# EasyEDA Pro project Project002.eprj

# Schematic 小车电路原理图
Board Name: Board1; Create Date: 2025-11-09; Page Name: P1; Project Name: Project002; Schematic Name: 小车电路原理图; Update Date: 2025-11-13; Company: 嘉立创EDA; Page Size: A4; Version: V1.0
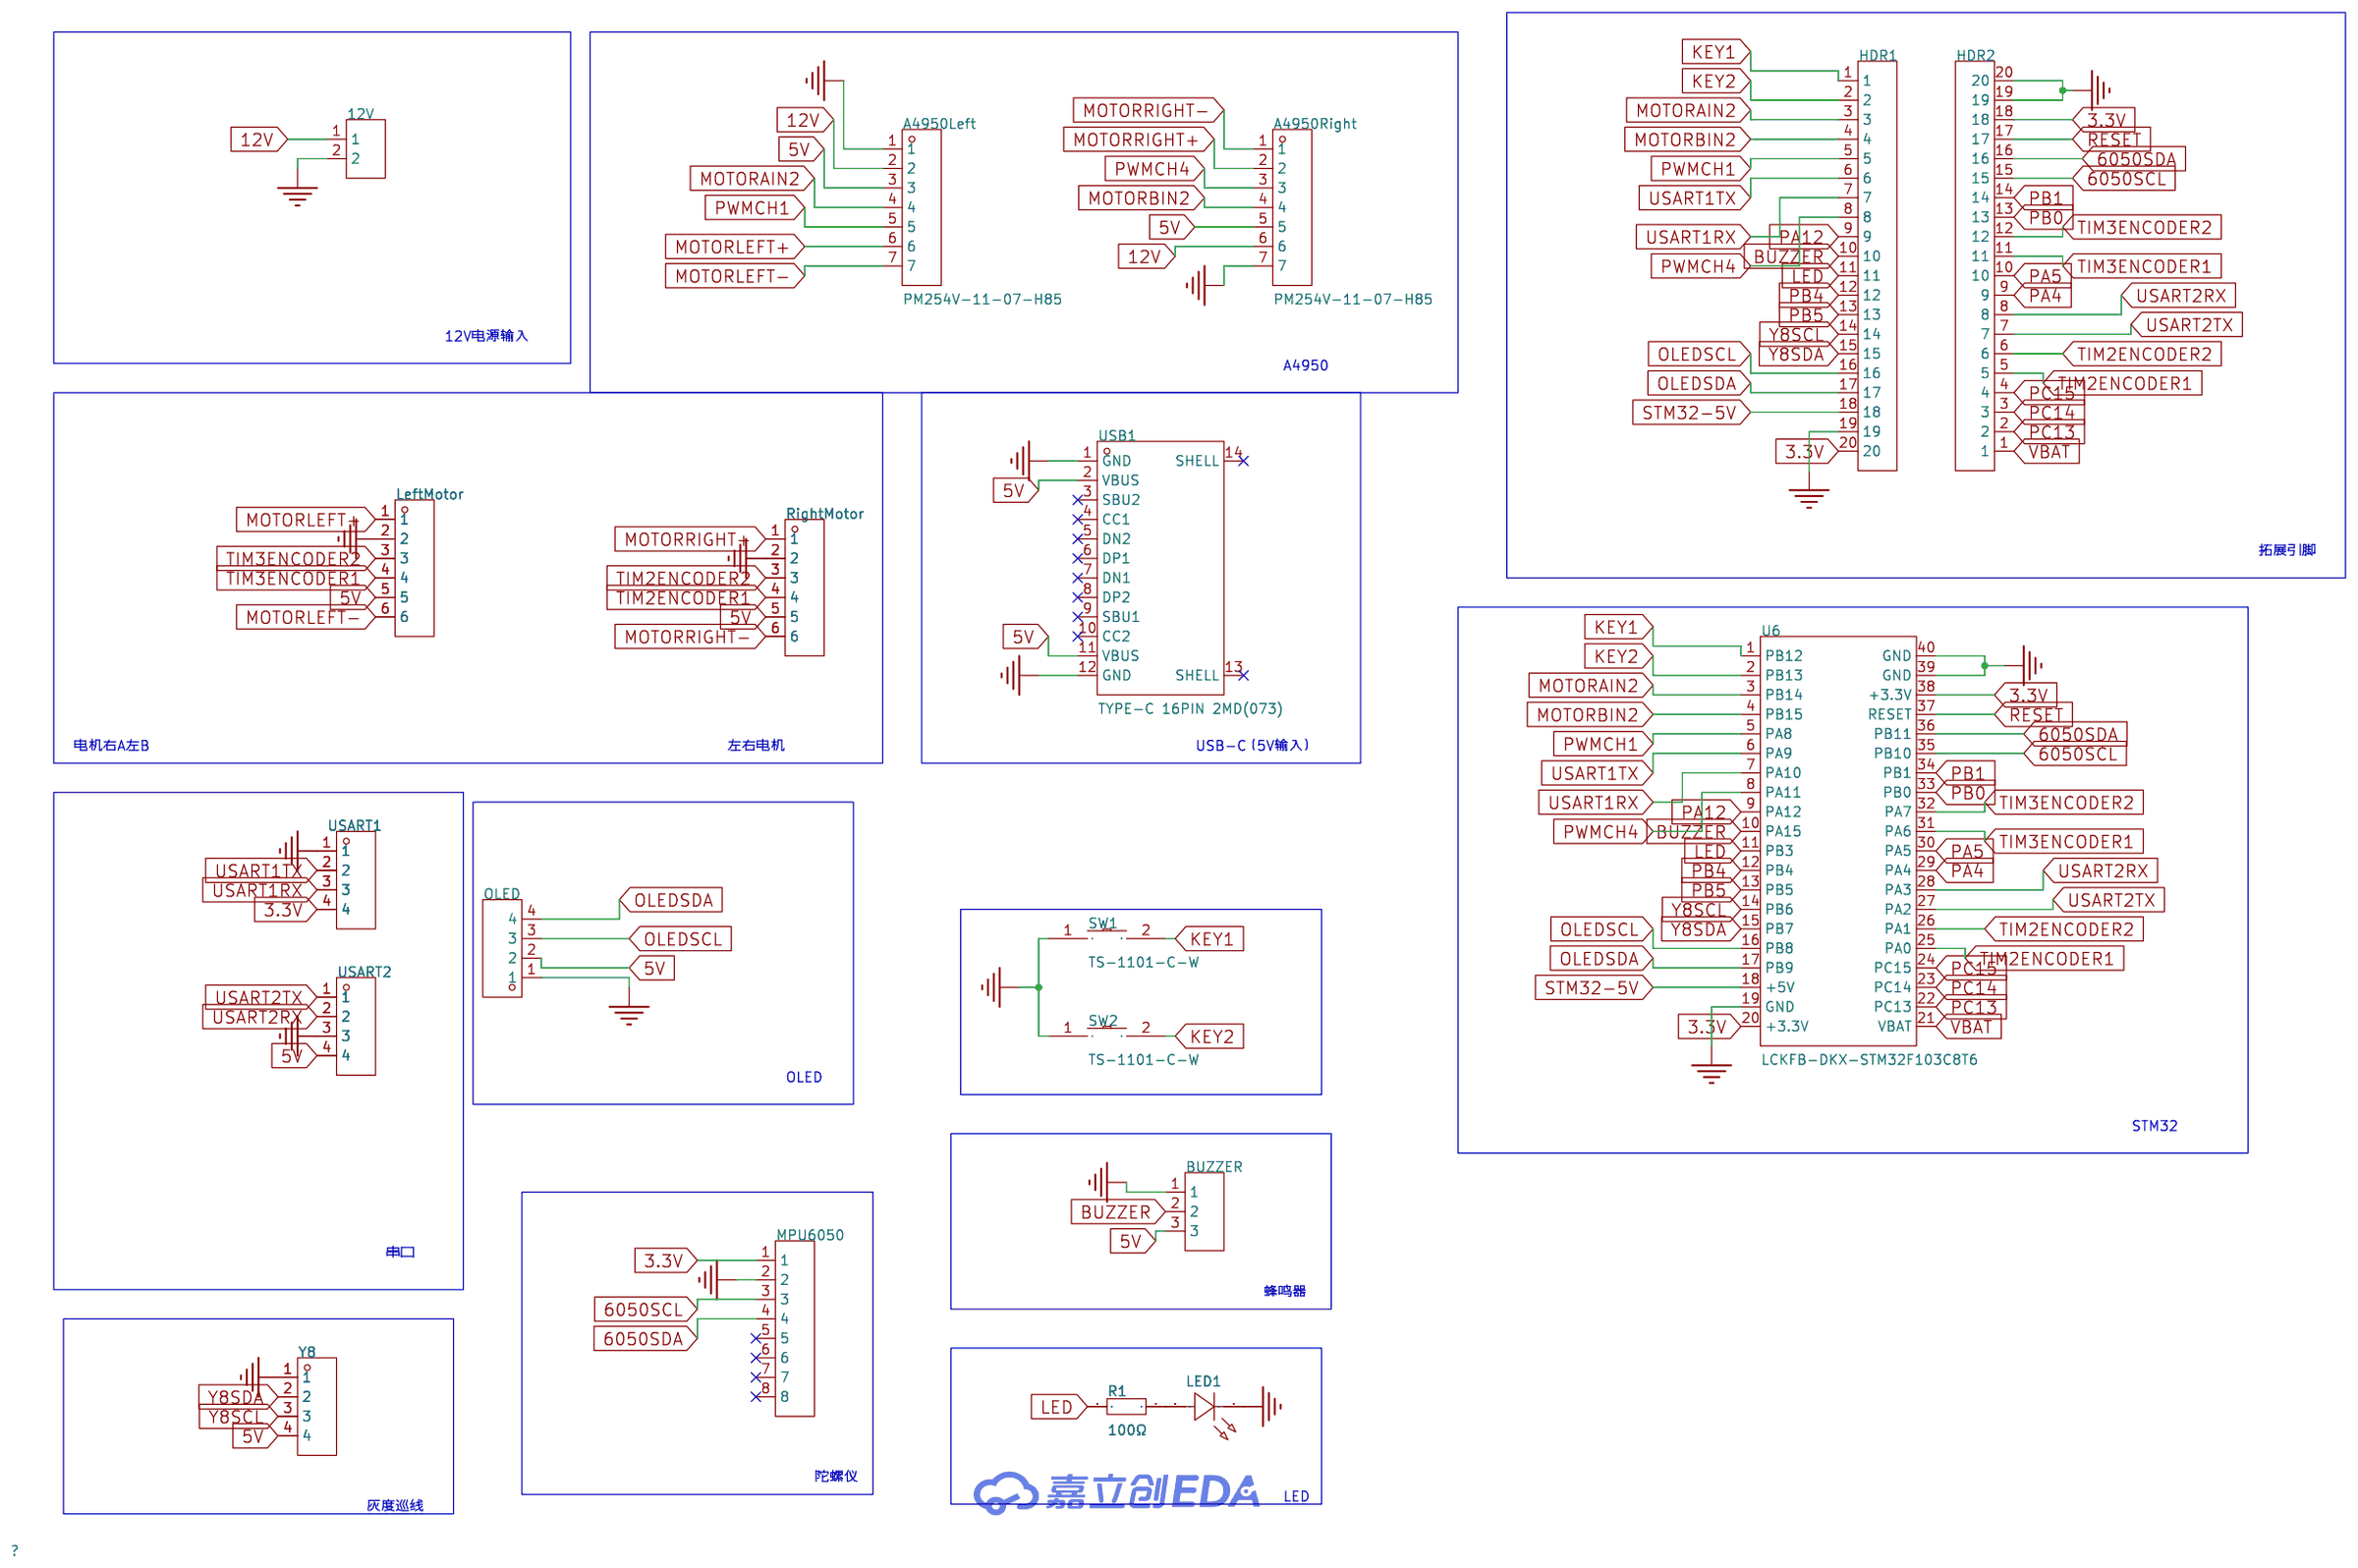
[diagram p0: schematic sheet]

## Parts
12V  12V  [CONN-TH_2P-P2.50_HX25003-2A]
A4950Left  PM254V-11-07-H85  [HDR-TH_7P-P2.54-V-F]
A4950Right  PM254V-11-07-H85  [HDR-TH_7P-P2.54-V-F]
BUZZER  PM254V-11-03-H85  [HDR-TH_3P-P2.54-V-F]
HDR1  PH2.54-01-20PZD  [HDR-TH_20P-P2.54-V-M-4]
HDR2  PH2.54-01-20PZD  [HDR-TH_20P-P2.54-V-M-4]
LED1  3A2RUD  [LED-TH_BD3.5-P2.28_3A2RUC]
LeftMotor  LeftMotor  [CONN-TH_6P-P2.50_ZX-XH2.54-6PZZ]
MPU6050  2.54-1*8P母环保  [HDR-TH_8P-P2.54-V-F_2]
OLED  USART1  [HDR-TH_4P-P2.54-V-F]
R1  100Ω  [R0603]
RightMotor  RightMotor  [CONN-TH_6P-P2.50_ZX-XH2.54-6PZZ]
SW1  TS-1101-C-W  [SW-SMD_L6.0-W3.3-LS8.0]
SW2  TS-1101-C-W  [SW-SMD_L6.0-W3.3-LS8.0]
U6  LCKFB-DKX-STM32F103C8T6  [CONN-TH_L53.3-W22.9_STM32F103C8T6-CARD]
USART1  USART1  [HDR-TH_4P-P2.54-V-F]
USART2  USART2  [HDR-TH_4P-P2.54-V-F]
USB1  TYPE-C 16PIN 2MD(073)  [USB-C-SMD_TYPE-C-6PIN-2MD-073]
Y8  PH2.0-4P  [CONN-TH_PH2.0-4P]

## Library data of the parts
12V = ZX-XH2.54-2PZZ: 插针结构:1x2P;间距:2.5mm;安装方式:直插;参考系列:XH;总PIN数:2P;排数:1;每排PIN数:2;行距:-;额定电流:2A;触头材质:黄铜;触头镀层:锡;工作温度:-25℃~+85℃;; LCSC Part Name: 1x2P 间距:2.5mm 直插 系列:XH; Supplier Part: C7429632; Manufacturer: Megastar(兆星); Supplier Footprint: 插件,P=2.5mm; JLCPCB Part Class: Extended Part; Datasheet: https://item.szlcsc.com/datasheet/ZX-XH2.54-2PZZ/8427549.html; Supplier: LCSC; Pins Structure: 1x2P; Pitch: 2.5mm; Mounting Type: 直插; Reference Series: XH; Number of Pins: 2P; Number of Rows: 1; Number of PINs Per Row: 2; Current Rating: 2A; Contact Material: 黄铜; Contact Plating: 锡; Operating Temperature: -25℃~+85℃; Voltage Rating: 250V; Plastic Material: PA66; Flame Retardant Rating: UL94V-0; Color: 白色; Z-Height of the Board: 7mm; X-Length of Bottom Edge on Board (Spacing Line): 7.5mm; Y-Width of Bottom Edge on Board: 5.9mm
A4950Left A4950Right = PM254V-11-07-H85: 插孔结构:1x7P;间距:2.54mm;行距:-;圆孔/方孔:方孔;安装方式:直插;排数:单排;总孔位数:7P;额定电流:3A;额定电压:250V;插孔方向:顶部;塑高:-;工作温度:-40℃~+105℃;; LCSC Part Name: 间距:2.54mm 1x7P 直插; Supplier Part: C2832270; Manufacturer: XFCN(兴飞); Supplier Footprint: 插件,P=2.54mm; JLCPCB Part Class: 扩展库; Datasheet: https://item.szlcsc.com/datasheet/PM254V-11-07-H85/2989788.html; Supplier: LCSC; Holes Structure: 1x7P; Pitch: 2.54mm; Circular Hole / Square Hole: 方孔; Mounting Type: 直插; Number of Rows: 单排; Number of Positions: 7P; Current Rating: 3A; Voltage Rating (Max): 250V; Holes Direction: 顶部; Operating Temperature: -40℃~+105℃
BUZZER = PM254V-11-03-H85: LCSC Part Name: 1x3P 间距:2.54mm 直插; Supplier Part: C541850; Manufacturer: XFCN(兴飞); Supplier Footprint: 插件,P=2.54mm; JLCPCB Part Class: 扩展库; Datasheet: https://item.szlcsc.com/datasheet/PM254V-11-03-H85/562471.html; Supplier: LCSC; Holes Structure: 1x3P; Pitch: 2.54mm; Circular Hole / Square Hole: 方孔; Mounting Type: 直插; Number of Rows: 单排; Number of Positions: 3P; Current Rating: 3A; Holes Direction: 顶部; Insulation Height: 8.5mm; Contact Material: 黄铜; Operating Temperature: -40℃~+105℃
HDR1 HDR2 = PH2.54-01-20PZD: 插针结构:1x20P;间距:2.54mm;圆针/方针:方针;安装方式:直插;排数:单排;总PIN位数:20P;额定电流:3A;配合针长度:6mm;塑高:2.5mm;端接针长度:3mm;触头材质:黄铜;触头镀层:金;工作温度:-40℃~+105℃;颜色:黑色;; LCSC Part Name: 1x20P 间距:2.54mm 方针 直插; Supplier Part: C7501591; Manufacturer: XUNPU(讯普); Supplier Footprint: 插件,P=2.54mm; JLCPCB Part Class: 扩展库; Datasheet: https://item.szlcsc.com/datasheet/PH2.54-01-20PZD/8584145.html; Supplier: LCSC; Pin Structure: 1x20P; Pitch: 2.54mm; Circluar Pins/Square Pins: 方针; Mounting Type: 直插; Number of Rows: 单排; Number of Pins: 20P; Current Rating: 3A; Length of Mating Pin: 6mm; Insulation Height: 2.5mm; Length of End Connection Pin: 3mm; Contact Material: 黄铜; Contact Plating: 金; Operating Temperature: -40℃~+105℃; Color: 黑色
LED1 = 3A2RUD: LCSC Part Name: 3mm 红发红短脚; Supplier Part: C52034637; Manufacturer: Guiguang light(桂光光电); Supplier Footprint: 插件,D=3mm; JLCPCB Part Class: 扩展库; Datasheet: https://item.szlcsc.com/datasheet/3A2RUD/54791005.html; Supplier: LCSC; Lamp Holder Type: 3mm圆形灯头; Illumination Color: 红色; Voltage - Forward(Vf): 1.8V~2.2V; Forward Current: 20mA; Wavelength - Dominant: 620nm~625nm; Peak Wavelength: 625nm; Lens Color: 红色透镜; Luminous Intensity: 200mcd~400mcd; Viewing Angle: 30°; Operating Temperature: -40℃~+85℃
LeftMotor RightMotor = ZX-XH2.54-6PZZ: 插针结构:1x6P;间距:2.5mm;安装方式:直插;参考系列:XH;总PIN数:6P;排数:1;每排PIN数:6;行距:-;额定电流:3A;触头材质:黄铜;触头镀层:锡;工作温度:-25℃~+85℃;; LCSC Part Name: 1x6P 间距:2.5mm 直插 系列:XH; Supplier Part: C7429636; Manufacturer: Megastar(兆星); Supplier Footprint: 插件,P=2.5mm; JLCPCB Part Class: 扩展库; Datasheet: https://item.szlcsc.com/datasheet/ZX-XH2.54-6PZZ/8427553.html; Supplier: LCSC; Pins Structure: 1x6P; Pitch: 2.5mm; Mounting Type: 直插; Reference Series: XH; Number of Pins: 6P; Number of Rows: 1; Number of PINs Per Row: 6; Current Rating: 3A; Contact Material: 黄铜; Contact Plating: 锡; Operating Temperature: -25℃~+85℃; Voltage Rating: 250V; Plastic Material: PA66; Flame Retardant Rating: UL94V-0; Color: 白色; Z-Height of the Board: 7mm; X-Length of Bottom Edge on Board (Spacing Line): 17.5mm; Y-Width of Bottom Edge on Board: 5.9mm
MPU6050 = 2.54-1*8P母环保: 插孔结构:1x8P;间距:2.54mm;行距:-;圆孔/方孔:方孔;安装方式:直插;排数:单排;总孔位数:8P;插孔方向:顶部;塑高:-;触头材质:-;触头镀层:-;; LCSC Part Name: 1x8P 间距:2.54mm 直插; Supplier Part: C27438; Manufacturer: BOOMELE(博穆精密); Supplier Footprint: 插件,P=2.54mm; JLCPCB Part Class: 扩展库; Datasheet: https://item.szlcsc.com/datasheet/2.54-1*8P%25E6%25AF%258D%25E7%258E%25AF%25E4%25BF%259D/28187.html; Supplier: LCSC; Holes Structure: 1x8P; Pitch: 2.54mm; Circular Hole / Square Hole: 方孔; Mounting Type: 直插; Number of Rows: 单排; Number of Positions: 8P; Holes Direction: 顶部
OLED USART1 USART2 = 2.54-1*4P母: 插孔结构:1x4P;间距:2.54mm;行距:-;圆孔/方孔:方孔;安装方式:直插;排数:单排;总孔位数:4P;额定电流:3A;额定电压:-;插孔方向:顶部;塑高:-;触头材质:青铜;触头镀层:-;工作温度:-40℃~+105℃;; LCSC Part Name: 间距:2.54mm 1x4P 直插; Supplier Part: C2718488; Manufacturer: BOOMELE(博穆精密); Supplier Footprint: 插件,P=2.54mm; JLCPCB Part Class: 扩展库; Datasheet: https://item.szlcsc.com/datasheet/2.54-1*4P%25E6%25AF%258D/2834502.html; Supplier: LCSC; Holes Structure: 1x4P; Pitch: 2.54mm; Circular Hole / Square Hole: 方孔; Mounting Type: 直插; Number of Rows: 单排; Number of Positions: 4P; Current Rating: 3A; Holes Direction: 顶部; Contact Material: 青铜; Operating Temperature: -40℃~+105℃
R1 = 0603WAF1000T5E: LCSC Part Name: 100Ω ±1% 100mW 厚膜电阻; Supplier Part: C22775; Manufacturer: UNI-ROYAL(厚声); Supplier Footprint: 0603; JLCPCB Part Class: 基础库; Datasheet: https://atta.szlcsc.com/upload/public/pdf/source/20200306/C422600_1E6D84923E4A46A82E41ADD87F860B5C.pdf; Supplier: LCSC; Type: 厚膜电阻; Tolerance: ±1%; Power(Watts): 100mW; Overload Voltage (Max): 75V; Temperature Coefficient: ±200ppm/℃; Operating Temperature Range: -55℃~+155℃
SW1 SW2 = TS-1101-C-W: 电路结构:单刀单掷;按钮形状:矩形按钮;作用力:260gf;安装方式:立贴;开关长度:6mm;开关宽度:3.6mm;开关高度:2.5mm;带支架:不带;触点电流:50mA;额定电压(AC):-;额定电压(DC):12V;额定功率:-;绝缘电阻:-;带灯:无;机械寿命:5万次;; LCSC Part Name: 6*3.6*2.5mm 立贴 轻触开关; Supplier Part: C318938; Manufacturer: XKB Connectivity(中国星坤); Supplier Footprint: SMD; JLCPCB Part Class: 扩展库; Datasheet: https://atta.szlcsc.com/upload/public/pdf/source/20200227/C318938_C2E53B1EEDE37D980A33616AC086DE53.pdf; Supplier: LCSC; Circuit: 单刀单掷; Actuator Style: 矩形按钮; Operating Force: 260gf; Mounting Style: 立贴; Switch Length: 6mm; Switch Width: 3.6mm; Switch Height: 2.5mm; Strike Gundam: 不带; Contact Current: 50mA; Voltage Rating (DC): 12V; Actuator/Cap Color: 白色带淡绿; With Lamp: 无; Mechanical Life: 5万次; Operating Temperature: -30℃~+85℃
U6 = LCKFB-DKX-STM32F103C8T6: LCSC Part Name: 立创·地阔星-STM32F103C8T6开发板; Supplier Part: C22396880; Manufacturer: 立创开发板; JLCPCB Part Class: 扩展库; Datasheet: https://item.szlcsc.com/datasheet/LCKFB-DKX-STM32F103C8T6/24005615.html; Supplier: LCSC
USB1 = TYPE-C 16PIN 2MD(073): 连接器类型:Type-C;协议标准:-;公母:母;安装方式:卧贴;触点数量:16P;端口数量:1;额定电流 - 电源:3A;工作温度:-25℃~+85℃;; LCSC Part Name: Type-C 母 卧贴; Supplier Part: C2765186; Manufacturer: SHOU HAN(首韩); Supplier Footprint: SMD; JLCPCB Part Class: 扩展库; Datasheet: https://item.szlcsc.com/datasheet/TYPE-C%252016PIN%25202MD(073)/2901843.html; Supplier: LCSC; Connector Type: Type-C; Gender: 母; Mounting Type: 卧贴; Number of Contacts: 16P; Number of Ports: 1; Current Rating-Power: 3A; Voltage Rating: 5V; Connect-Disconnect Life: 5千次; Detection color: 黑色; Operating Temperature: -25℃~+85℃
Y8 = PH2.0-4P_C722763: 插针结构:1x4P;间距:2mm;安装方式:直插;参考系列:-;总PIN数:4P;排数:1;每排PIN数:4;行距:-;额定电流:5A;工作温度:-25℃~+85℃;; LCSC Part Name: 1x4P 间距:2mm 直插; Supplier Part: C722763; Manufacturer: CAX(创都); Supplier Footprint: 插件,P=2mm; JLCPCB Part Class: 扩展库; Datasheet: https://item.szlcsc.com/datasheet/PH2.0-4P/766970.html; Supplier: LCSC; Pins Structure: 1x4P; Pitch: 2mm; Mounting Type: 直插; Number of Pins: 4P; Number of Rows: 1; Number of PINs Per Row: 4; Current Rating: 5A; Operating Temperature: -25℃~+85℃

## Nets
3.3V: HDR1.20 HDR2.18 MPU6050.1 U6.20(+3.3V) U6.38(+3.3V) USART1.4
5V: A4950Left.3 A4950Right.5 BUZZER.3 LeftMotor.5 OLED.2 RightMotor.5 USART2.4 USB1.2(VBUS) USB1.11(VBUS) Y8.4
12V: 12V.1 A4950Left.2 A4950Right.6
GND: 12V.2 A4950Left.1 A4950Right.7 BUZZER.1 HDR1.19 HDR2.19 HDR2.20 LED1.1(K) LeftMotor.2 MPU6050.2 OLED.1 RightMotor.2 SW1.1 SW2.1 U6.19(GND) U6.39(GND) U6.40(GND) USART1.1 USART2.3 USB1.1(GND) USB1.12(GND) Y8.1
VBAT: HDR2.1 U6.21(VBAT)
6050SCL: HDR2.15 MPU6050.3 U6.35(PB10)
6050SDA: HDR2.16 MPU6050.4 U6.36(PB11)
BUZZER: BUZZER.2 HDR1.10 U6.10(PA15)
KEY1: HDR1.1 SW1.2 U6.1(PB12)
KEY2: HDR1.2 SW2.2 U6.2(PB13)
LED: HDR1.11 R1.2 U6.11(PB3)
MOTORAIN2: A4950Left.4 HDR1.3 U6.3(PB14)
MOTORBIN2: A4950Right.4 HDR1.4 U6.4(PB15)
MOTORLEFT+: A4950Left.6 LeftMotor.1
MOTORLEFT-: A4950Left.7 LeftMotor.6
MOTORRIGHT+: A4950Right.2 RightMotor.1
MOTORRIGHT-: A4950Right.1 RightMotor.6
OLEDSCL: HDR1.16 OLED.3 U6.16(PB8)
OLEDSDA: HDR1.17 OLED.4 U6.17(PB9)
PA4: HDR2.9 U6.29(PA4)
PA5: HDR2.10 U6.30(PA5)
PA12: HDR1.9 U6.9(PA12)
PB0: HDR2.13 U6.33(PB0)
PB1: HDR2.14 U6.34(PB1)
PB4: HDR1.12 U6.12(PB4)
PB5: HDR1.13 U6.13(PB5)
PC13: HDR2.2 U6.22(PC13)
PC14: HDR2.3 U6.23(PC14)
PC15: HDR2.4 U6.24(PC15)
PWMCH1: A4950Left.5 HDR1.5 U6.5(PA8)
PWMCH4: A4950Right.3 HDR1.8 U6.8(PA11)
RESET: HDR2.17 U6.37(RESET)
STM32-5V: HDR1.18 U6.18(+5V)
TIM2ENCODER1: HDR2.5 RightMotor.4 U6.25(PA0)
TIM2ENCODER2: HDR2.6 RightMotor.3 U6.26(PA1)
TIM3ENCODER1: HDR2.11 LeftMotor.4 U6.31(PA6)
TIM3ENCODER2: HDR2.12 LeftMotor.3 U6.32(PA7)
USART1RX: HDR1.7 U6.7(PA10) USART1.3
USART1TX: HDR1.6 U6.6(PA9) USART1.2
USART2RX: HDR2.8 U6.28(PA3) USART2.2
USART2TX: HDR2.7 U6.27(PA2) USART2.1
Y8SCL: HDR1.14 U6.14(PB6) Y8.3
Y8SDA: HDR1.15 U6.15(PB7) Y8.2
$1N30053: LED1.2(A) R1.1

Not connected (* = marked no-connect by the designer): MPU6050 5* 6* 7* 8*; USB1 3(SBU2)* 4(CC1)* 5(DN2)* 6(DP1)* 7(DN1)* 8(DP2)* 9(SBU1)* 10(CC2)* 13(SHELL)* 14(SHELL)*

## Notes on the sheet
- 12V电源输入
- A4950
- 拓展引脚
- 电机右A左B
- 左右电机
- USB-C（5V输入）
- OLED
- STM32
- 串口
- 蜂鸣器
- 陀螺仪
- 灰度巡线
- LED

# Board PCB1
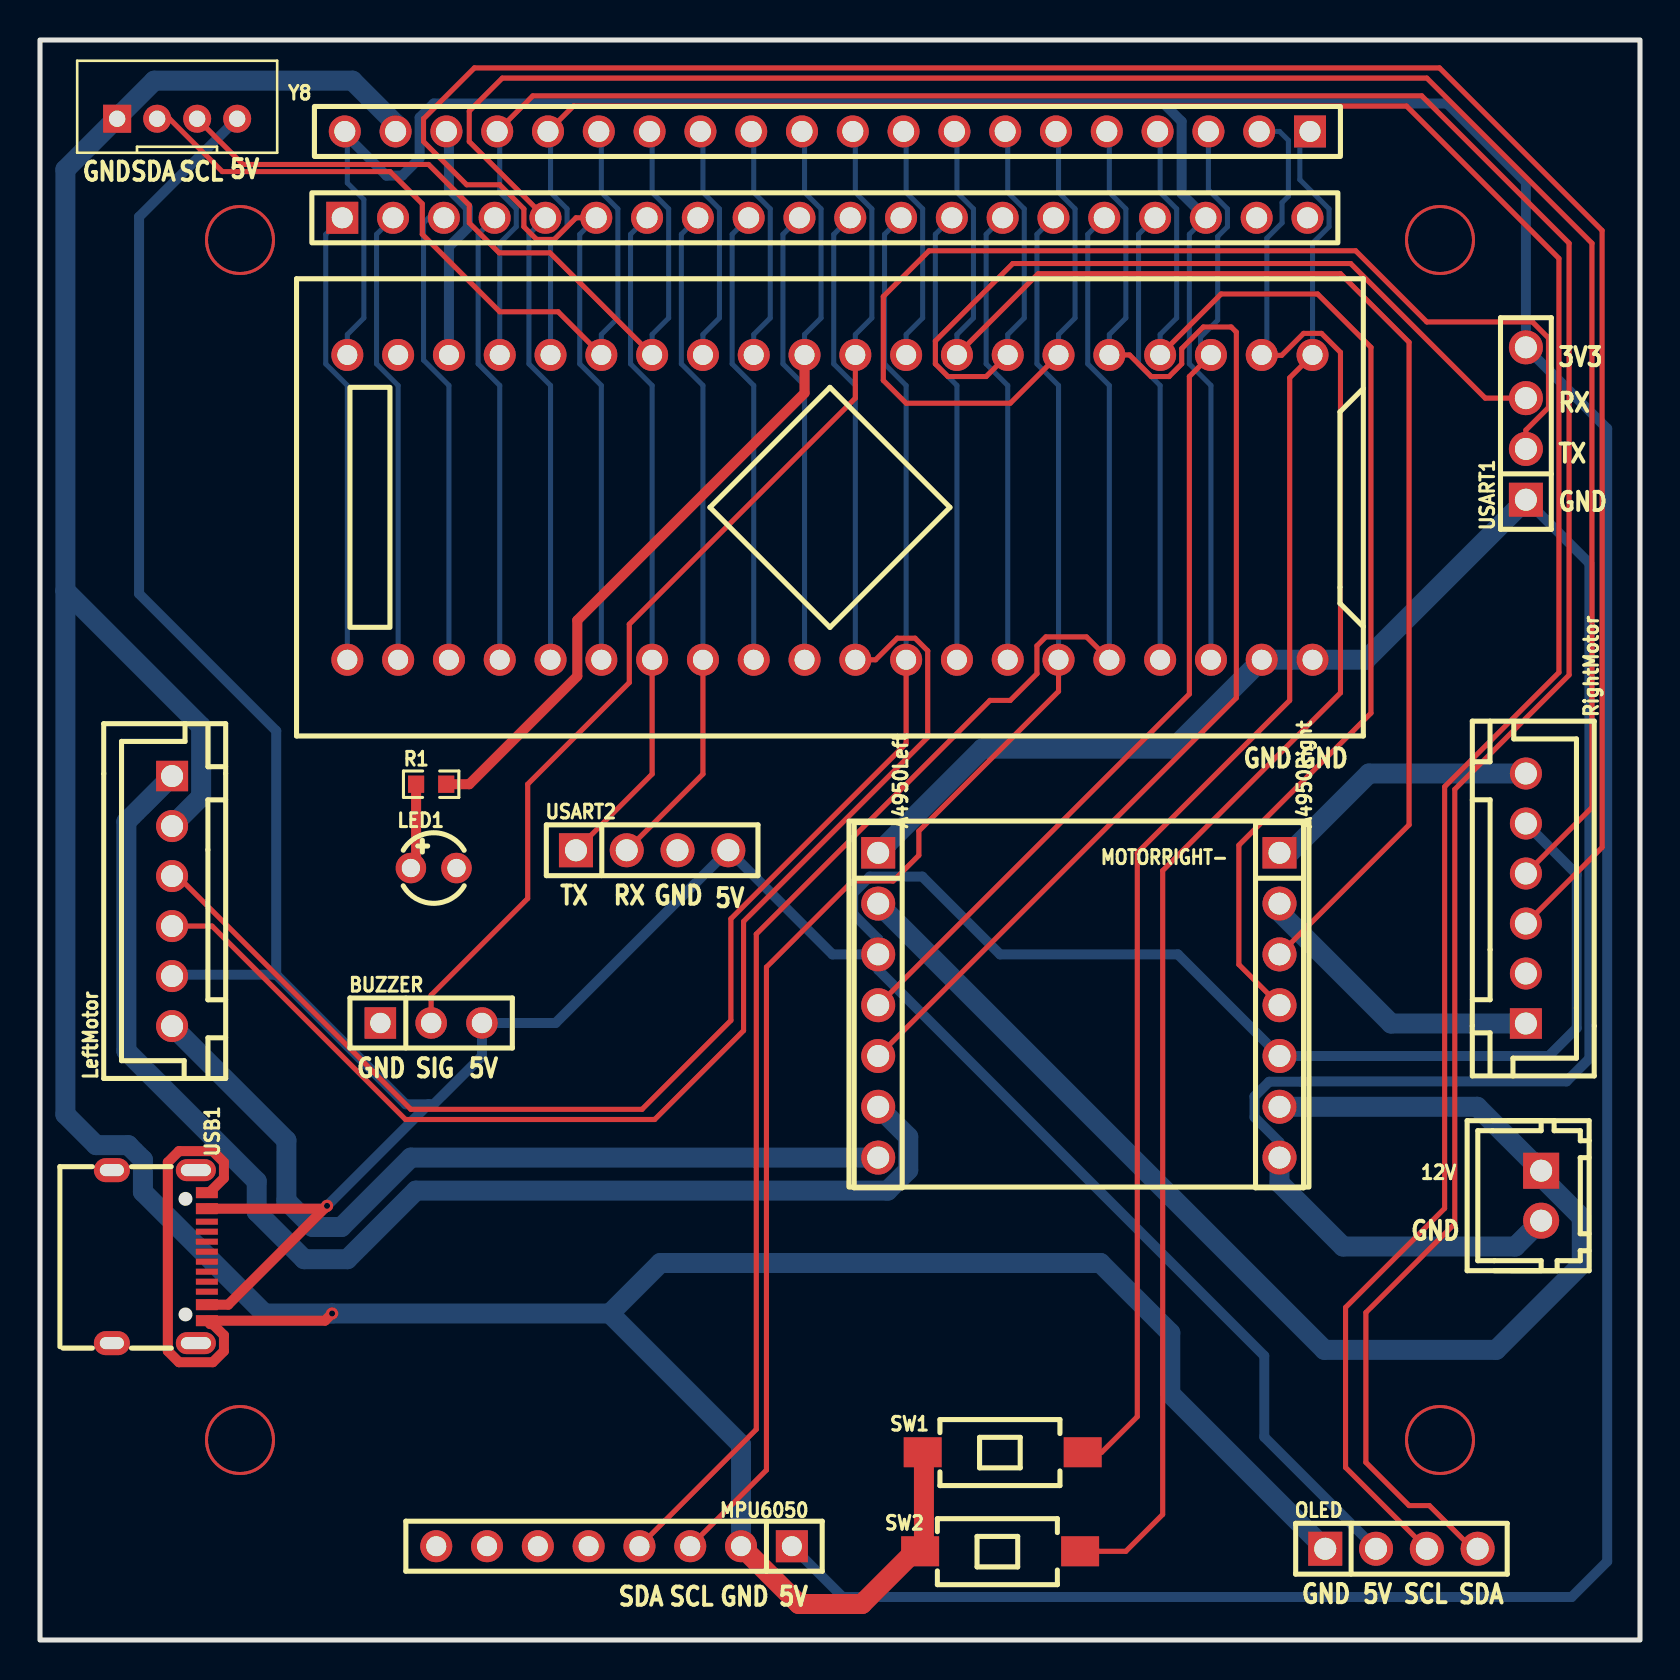
[diagram p1: board, top side]
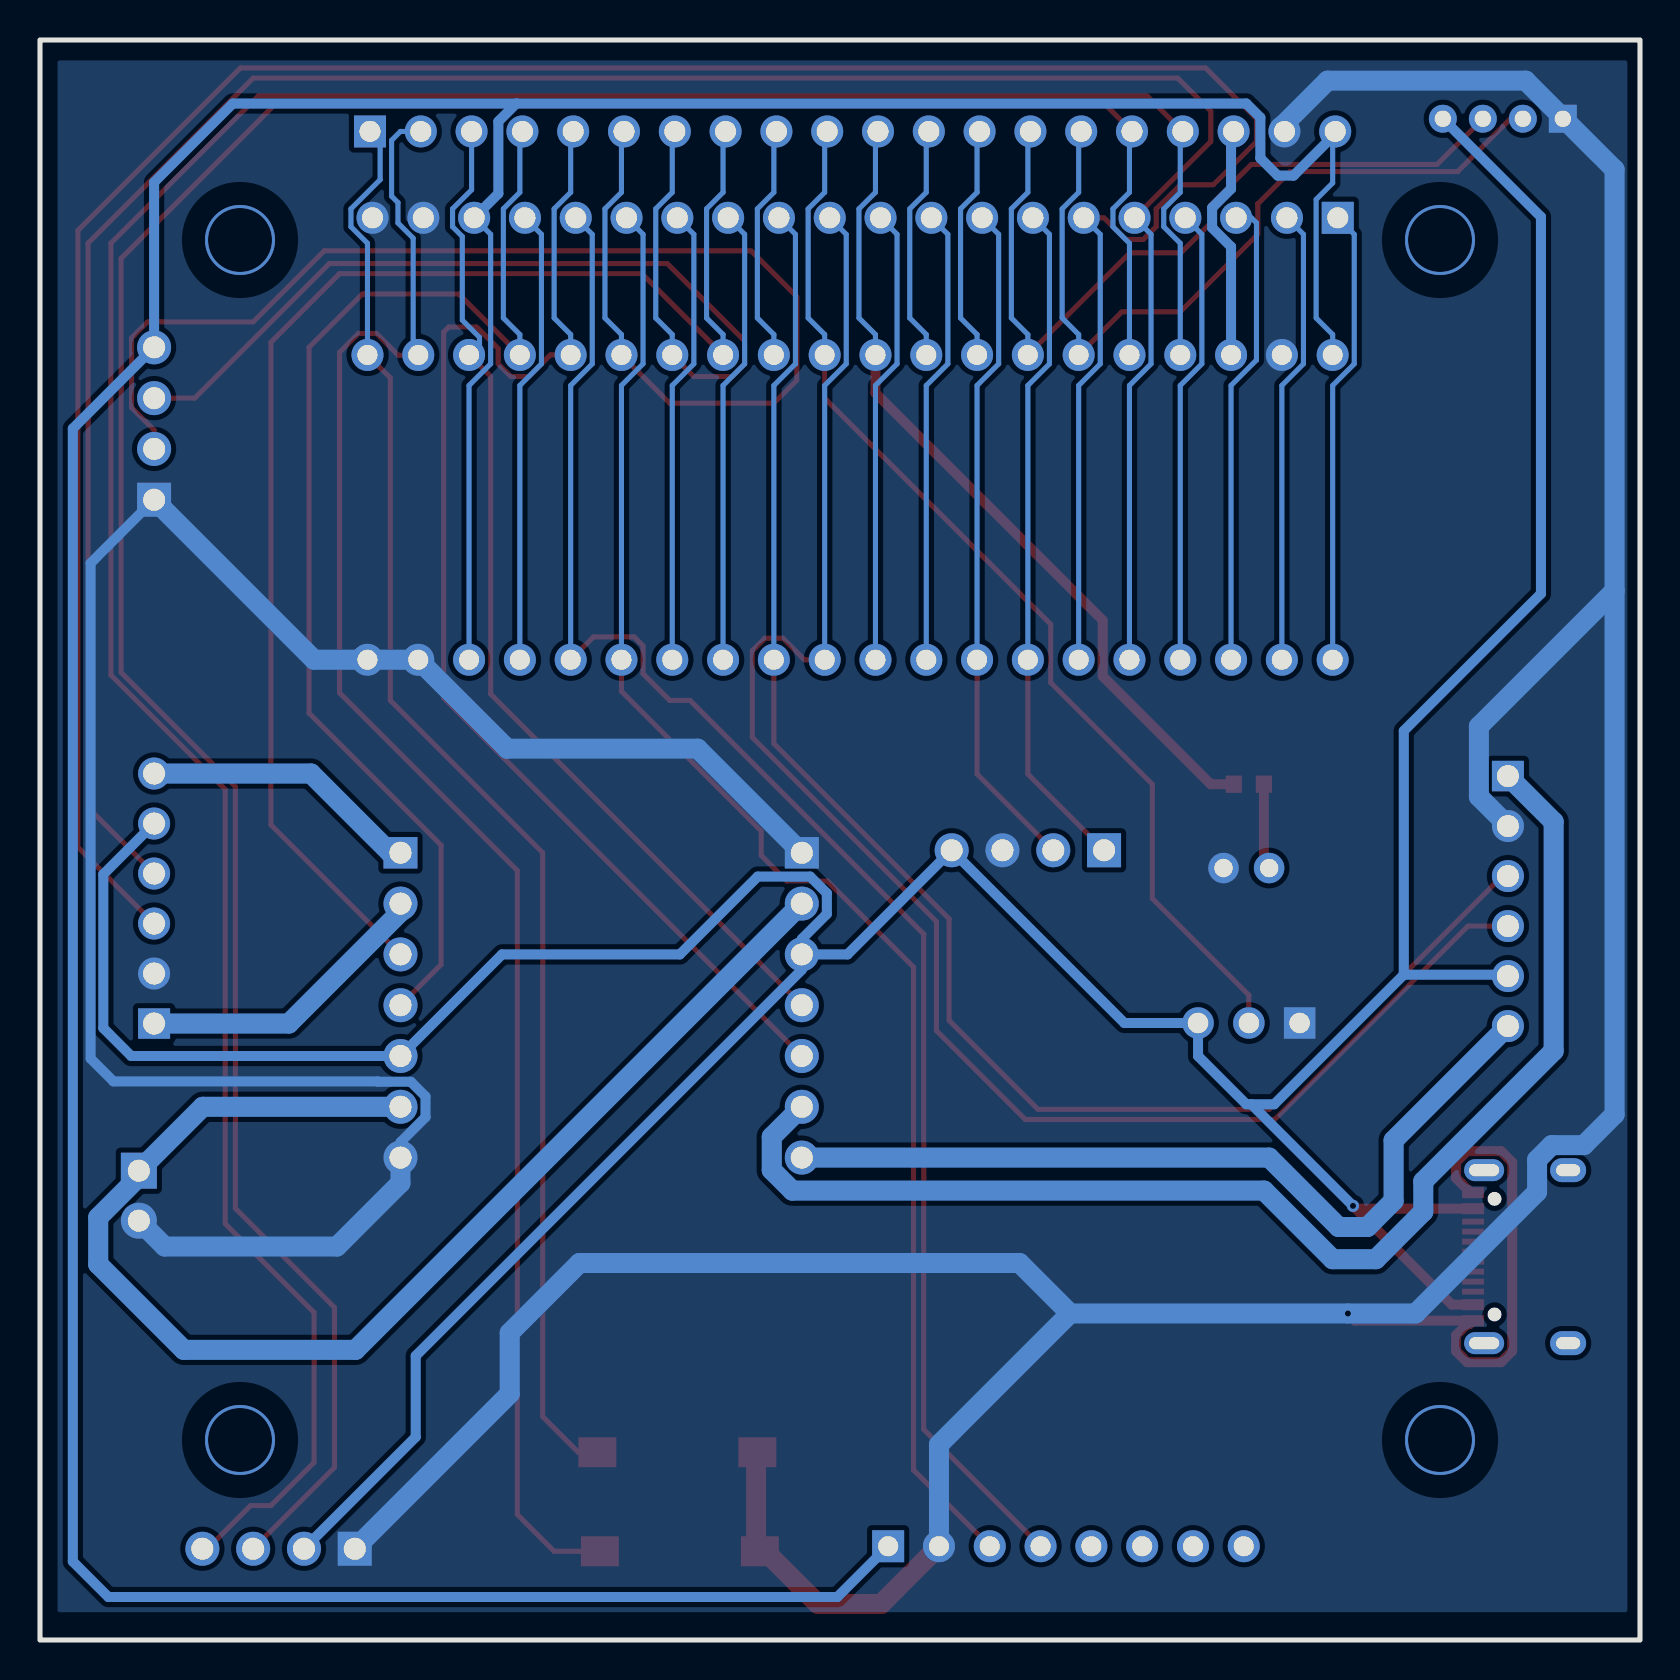
[diagram p2: board, bottom side, seen from below]

Outline 80 x 80 mm; copper layers: Top Layer, Bottom Layer. Coordinates in mm from the lower left corner of the outline.
Outline path: rectangle 0,80 80,0
Stack: Top Layer 0.035mm / Dielectric1 1.51mm FR4 er 4.5 / Bottom Layer 0.035mm

## Design rules (mm)
template: 自定义配置
spacing copperThickness1oz (default): track to track 0.102, other pairs 0.152 to 0.3
spacing copperThickness2oz: track to track 0.203, other pairs 0.152 to 0.3
track width copperThickness1oz (default): min 0.127, default 0.254, max 2.54
track width copperThickness2oz: min 0.203, default 0.254, max 2.54
differential pair differentialPair (default): width min 0.127, default 0.254, max 2.54; gap min 0.152, default 0.152
via viaSize (default): diameter min 0.5, default 0.61, max 10; hole min 0.3, default 0.305, max 6.3

## Placement (name value [footprint] x y rotation side)
12V  12V  [CONN-TH_2P-P2.50_HX25003-2A]  75.06 22.22 270 top
A4950Left  PM254V-11-07-H85  [HDR-TH_7P-P2.54-V-F]  41.91 31.74 270 top
A4950Right  PM254V-11-07-H85  [HDR-TH_7P-P2.54-V-F]  61.98 31.74 270 top
BUZZER  PM254V-11-03-H85  [HDR-TH_3P-P2.54-V-F]  19.56 30.85 0 top
HDR1  PH2.54-01-20PZD  [HDR-TH_20P-P2.54-V-M-4]  39.37 75.43 180 top
HDR2  PH2.54-01-20PZD  [HDR-TH_20P-P2.54-V-M-4]  39.24 71.11 0 top
LED1  3A2RUD  [LED-TH_BD3.5-P2.28_3A2RUC]  19.69 38.6 0 top
LeftMotor  LeftMotor  [CONN-TH_6P-P2.50_ZX-XH2.54-6PZZ]  6.6 36.95 90 top
MPU6050  2.54-1*8P母环保  [HDR-TH_8P-P2.54-V-F_2]  28.7 4.69 180 top
OLED  USART1  [HDR-TH_4P-P2.54-V-F]  68.07 4.56 0 top
R1  100Ω  [R0603]  19.56 42.79 0 top
RightMotor  RightMotor  [CONN-TH_6P-P2.50_ZX-XH2.54-6PZZ]  74.29 37.07 270 top
SW1  TS-1101-C-W  [SW-SMD_L6.0-W3.3-LS8.0]  48.13 9.39 0 top
SW2  TS-1101-C-W  [SW-SMD_L6.0-W3.3-LS8.0]  48.01 4.44 0 top
U6  LCKFB-DKX-STM32F103C8T6  [CONN-TH_L53.3-W22.9_STM32F103C8T6-CARD]  39.5 56.63 180 top
USART1  USART1  [HDR-TH_4P-P2.54-V-F]  74.29 60.82 90 top
USART2  USART2  [HDR-TH_4P-P2.54-V-F]  30.61 39.49 0 top
USB1  TYPE-C 16PIN 2MD(073)  [USB-C-SMD_TYPE-C-6PIN-2MD-073]  5.97 19.17 270 top
Y8  PH2.0-4P  [CONN-TH_PH2.0-4P]  6.86 76.06 0 top

## Footprints (pads in the part's own frame, mm; a bottom-side part is the same pattern mirrored in y, then rotated)
CONN-TH_2P-P2.50_HX25003-2A
  rect 1.8x1.8 hole 1.1: 1(-1.25,0)
  round 1.8 hole 1.1: 2(1.25,0)
CONN-TH_6P-P2.50_ZX-XH2.54-6PZZ
  rect 1.524x1.6 hole 1.1: 1(6.25,0)
  round 1.6 hole 1.1: 2(3.75,0) 3(1.25,0) 4(-1.25,0) 5(-3.75,0) 6(-6.25,0)
CONN-TH_L53.3-W22.9_STM32F103C8T6-CARD
  round 1.6 hole 1: 1(-24.13,-7.62) 2(-21.59,-7.62) 3(-19.05,-7.62) 4(-16.51,-7.62) 5(-13.97,-7.62) 6(-11.43,-7.62) 7(-8.89,-7.62) 8(-6.35,-7.62) 9(-3.81,-7.62) 10(-1.27,-7.62) 11(1.27,-7.62) 12(3.81,-7.62) 13(6.35,-7.62) 14(8.89,-7.62) 15(11.43,-7.62) 16(13.97,-7.62) 17(16.51,-7.62) 18(19.05,-7.62) 19(21.59,-7.62) 20(24.13,-7.62) 21(24.13,7.62) 22(21.59,7.62) 23(19.05,7.62) 24(16.51,7.62) 25(13.97,7.62) 26(11.43,7.62) 27(8.89,7.62) 28(6.35,7.62) 29(3.81,7.62) 30(1.27,7.62) 31(-1.27,7.62) 32(-3.81,7.62) 33(-6.35,7.62) 34(-8.89,7.62) 35(-11.43,7.62) 36(-13.97,7.62) 37(-16.51,7.62) 38(-19.05,7.62) 39(-21.59,7.62) 40(-24.13,7.62)
CONN-TH_PH2.0-4P
  rect 1.4x1.4 hole 0.813: 1(-3,0)
  round 1.4 hole 0.813: 2(-1,0) 3(1,0) 4(3,0)
HDR-TH_3P-P2.54-V-F
  rect 1.575x1.575 hole 1.02: 1(-2.54,0)
  round 1.575 hole 1.02: 2(0,0) 3(2.54,0)
HDR-TH_4P-P2.54-V-F
  rect 1.7x1.7 hole 1.1: 1(-3.81,0)
  round 1.7 hole 1.1: 2(-1.27,0) 3(1.27,0) 4(3.81,0)
HDR-TH_7P-P2.54-V-F
  rect 1.575x1.7 hole 1.1: 1(-7.62,0)
  round 1.7 hole 1.1: 2(-5.08,0) 3(-2.54,0) 4(0,0) 5(2.54,0) 6(5.08,0) 7(7.62,0)
HDR-TH_8P-P2.54-V-F_2
  rect 1.6x1.6 hole 1: 1(-8.89,0)
  round 1.6 hole 1: 2(-6.35,0) 3(-3.81,0) 4(-1.27,0) 5(1.27,0) 6(3.81,0) 7(6.35,0) 8(8.89,0)
HDR-TH_20P-P2.54-V-M-4
  rect 1.6x1.6 hole 1.05: 1(-24.13,0)
  round 1.6 hole 1.05: 2(-21.59,0) 3(-19.05,0) 4(-16.51,0) 5(-13.97,0) 6(-11.43,0) 7(-8.89,0) 8(-6.35,0) 9(-3.81,0) 10(-1.27,0) 11(1.27,0) 12(3.81,0) 13(6.35,0) 14(8.89,0) 15(11.43,0) 16(13.97,0) 17(16.51,0) 18(19.05,0) 19(21.59,0) 20(24.13,0)
LED-TH_BD3.5-P2.28_3A2RUC
  round 1.524 hole 0.914: 1(1.14,0) 2(-1.14,0)
R0603
  rect 0.806x0.864 smd: 1(-0.753,0) 2(0.753,0)
SW-SMD_L6.0-W3.3-LS8.0
  rect 1.9x1.5 smd: 1(-4,0) 2(4,0)
USB-C-SMD_TYPE-C-6PIN-2MD-073
  rect 0.55x1.1 smd: 1(-3.2,2.375) 2(-2.4,2.375) 11(2.4,2.375) 12(3.2,2.375)
  rect 0.3x1.1 smd: 3(-1.75,2.375) 4(-1.25,2.375) 5(-0.75,2.375) 6(-0.25,2.375) 7(0.25,2.375) 8(0.75,2.375) 9(1.25,2.375) 10(1.75,2.375)
  oval 1.1x2 hole 0.6x1.5: 13(-4.325,1.825) 14(4.325,1.825)
  oval 1.2x1.8 hole 0.6x1.2: 13(-4.325,-2.375) 14(4.325,-2.375)

## Nets
As in the schematic.

Pads without a net: MPU6050 5 6 7 8; USB1 3 4 5 6 7 8 9 10 13 14

## Via types
v1: diameter 3.5, hole 3.2, Top Layer to Bottom Layer, 4 vias
v2: diameter 0.61, hole 0.305, Top Layer to Bottom Layer, 2 vias

## Routing (per net, layer and track width the routed paths; a pad name or vN(x,y) marks a point on that pad's centre or on a via; arc(x,y) is an arc through that point)
3.3V: length 218.6
  Bottom Layer w0.254: U6.20 15.37,65.27 16.19,66.1 16.19,72.03 15.37,72.85 15.37,75.17 ; U6.38 58.55,62.73 57.47,63.81 57.47,70.28 HDR2.18
  Bottom Layer w0.5: HDR2.18 57.08,72.32 57.08,75.93 56.18,76.83 ; HDR1.20 15.37,75.3 15.37,75.17 17.32,73.22 18.11,73.22 18.98,74.09 18.98,76.12 19.69,76.83 56.18,76.83 ; 56.18,76.83 70.36,76.83 74.29,72.89 USART1.4 78.36,60.57 78.36,3.93 76.58,2.15 40.13,2.15 MPU6050.1
5V: length 210.7
  Top Layer w0.5: USB1.2 14.21,21.57 9.41,16.77 USB1.11
  Bottom Layer w0.5: 19.43,26.79 18.29,26.79 11.81,33.26 ; 19.43,26.79 v2(14.35,21.71) ; 19.43,26.79 19.69,26.79 22.1,29.2 BUZZER.3 25.78,30.85 USART2.4 39.62,34.28 A4950Left.3 ; A4950Left.3 41.91,33.51 61.21,14.21 61.21,10.15 OLED.2 ; A4950Left.3 41.91,35.05 40.66,36.3 40.66,37.34 41.49,38.17 44.12,38.17 48.01,34.28 56.9,34.28 A4950Right.5 75.44,29.2 76.84,30.6 76.84,38.28 RightMotor.5 ; 11.81,33.26 6.67,33.26 LeftMotor.5 ; 11.81,33.26 11.81,45.46 4.95,52.31 4.95,71.16 Y8.4
12V: length 66.1
  Bottom Layer w1: A4950Right.6 71.86,26.66 12V.1 75.06,23.16 77.09,21.13 77.09,18.79 72.81,14.51 64.22,14.51 A4950Left.2
GND: length 321.9
  Top Layer w0.5: USB1.1 8.47,22.37 9.2,23.1 9.2,23.89 8.64,24.44 6.95,24.44 6.39,23.89 6.39,14.45 6.95,13.89 8.64,13.89 9.2,14.45 9.2,15.24 8.64,15.79 8.52,15.79 USB1.12 14.25,15.97 v2(14.61,16.33)
  Top Layer w1: SW1.1 44.2,9.32 44.2,4.9 41.1,1.8 37.94,1.8 MPU6050.2
  Bottom Layer w0.5: A4950Right.7 61.98,24.89 60.72,26.14 60.72,27.18 61.46,27.91 63.1,27.91 63.12,27.93 76.33,27.93 77.47,29.07 77.47,53.84 USART1.1
  Bottom Layer w1: USART1.1 66.29,49.01 U6.40 U6.39 56.64,44.57 47.12,44.57 A4950Left.1 ; 28.5,16.33 31.02,18.85 53.02,18.85 56.51,15.36 56.51,12.31 OLED.1 ; 28.5,16.33 35.05,9.77 MPU6050.2 ; 28.5,16.33 v2(14.61,16.33) 11.22,16.33 5.15,22.4 5.15,24.01 4.41,24.74 2.81,24.74 1.27,26.28 1.27,52.47 ; HDR1.19 17.78,75.81 15.62,77.97 5.72,77.97 1.27,73.52 1.27,52.47 ; 12V.2 73.77,19.68 65.15,19.68 61.98,22.85 A4950Right.7 ; 1.27,52.47 8.06,45.68 8.06,42.17 6.6,40.71 LeftMotor.2
VBAT: length 22.9
  Bottom Layer w0.254: HDR2.1 14.29,70.28 14.29,63.81 15.37,62.73 U6.21
(no net):
  vias: v1(10,70) v1(10,10) v1(70,70) v1(70,10)
6050SCL: length 76
  Top Layer w0.254: U6.35 50.93,47.43 43.94,40.45 43.94,39.23 42.66,37.95 40.63,37.95 36.32,33.64 36.32,8.5 MPU6050.3
  Bottom Layer w0.254: HDR2.15 49.85,70.28 49.85,63.81 50.93,62.73 U6.35
6050SDA: length 81
  Top Layer w0.254: U6.36 52.32,50.16 50.29,50.16 49.85,49.71 49.85,48.31 48.51,46.98 47.5,46.98 35.81,35.3 35.81,10.53 MPU6050.4
  Bottom Layer w0.254: HDR2.16 52.39,70.28 52.39,63.81 53.47,62.73 U6.36
BUZZER: length 54.1
  Top Layer w0.254: U6.10 40.77,62.09 29.46,50.79 29.46,47.87 24.38,42.79 24.38,37.07 19.56,32.25 BUZZER.2
  Bottom Layer w0.254: U6.10 40.77,65.27 41.59,66.1 41.59,71.56 40.77,72.38 40.77,75.3 HDR1.10
KEY1: length 72.9
  Top Layer w0.254: 51.75,9.39 53.09,9.39 54.86,11.17 54.86,39.36 62.48,46.98 62.48,63.11 U6.1
  Bottom Layer w0.254: HDR1.1 62.99,74.92 62.99,73.02 64.45,71.56 64.45,70.66 63.63,69.84 U6.1
KEY2: length 84.8
  Top Layer w0.254: U6.2 61.11,64.23 62.08,64.23 63.18,65.33 64.07,65.33 65.02,64.38 65.02,47.36 56.13,38.47 56.13,6.28 54.29,4.44 51.62,4.44
  Bottom Layer w0.254: U6.2 61.34,64.51 61.34,70.09 62.1,70.85 62.1,71.87 62.42,72.19 62.42,74.98 61.98,75.43 HDR1.2
LED: length 41.5
  Top Layer w0.5: R1.2 21.46,42.79 26.87,48.19 26.87,50.98 38.23,62.35 U6.11
  Bottom Layer w0.254: HDR1.11 38.23,75.3 38.23,72.38 39.05,71.56 39.05,66.1 38.23,65.27 U6.11
MOTORAIN2: length 51.7
  Top Layer w0.254: A4950Left.4 57.47,47.3 57.47,63.17 U6.3
  Bottom Layer w0.254: U6.3 58.03,64.77 58.03,65.13 58.88,65.99 58.88,70.17 59.37,70.66 59.37,71.56 58.42,72.51 HDR1.3
MOTORBIN2: length 61.3
  Top Layer w0.254: A4950Right.4 59.94,33.77 59.94,39.74 66.55,46.34 66.55,64.63 63.88,67.3 59.06,67.3 U6.4
  Bottom Layer w0.254: HDR1.4 56.01,75.3 56.01,72.38 56.83,71.56 56.83,66.1 56.01,65.27 U6.4
MOTORLEFT+: length 64.6
  Bottom Layer w1: A4950Left.6 43.41,25.16 43.41,23.5 42.38,22.47 18.8,22.47 15.37,19.04 13.21,19.04 10.84,21.41 10.84,22.94 4.32,29.45 4.32,40.91 LeftMotor.1
MOTORLEFT-: length 42.7
  Bottom Layer w1: LeftMotor.6 12.32,24.98 12.32,21.96 13.63,20.65 15.07,20.65 18.54,24.12 A4950Left.7
MOTORRIGHT+: length 15
  Bottom Layer w1: A4950Right.2 61.98,36.4 67.56,30.82 RightMotor.1
MOTORRIGHT-: length 14
  Bottom Layer w1: A4950Right.1 62.48,39.36 66.45,43.32 RightMotor.6
OLEDSCL: length 136.8
  Top Layer w0.254: HDR1.16 26.67,76.7 68.33,76.7 75.95,69.08 75.95,48.38 70.23,42.66 70.23,21.58 65.28,16.63 65.28,8.63 OLED.3
  Bottom Layer w0.254: HDR1.16 25.53,75.3 25.53,72.38 26.35,71.56 26.35,70.66 25.53,69.84 U6.16
OLEDSDA: length 141.8
  Top Layer w0.254: OLED.4 71.63,4.56 69.47,6.72 68.45,6.72 66.29,8.88 66.29,16.37 70.74,20.82 70.74,42.53 76.45,48.25 76.45,69.84 69.09,77.21 24.64,77.21 HDR1.17
  Bottom Layer w0.254: HDR1.17 22.99,75.3 22.99,72.38 23.81,71.56 23.81,70.66 22.99,69.84 U6.17
PA4: length 22.9
  Bottom Layer w0.254: HDR2.9 34.61,70.28 34.61,63.81 35.69,62.73 U6.29
PA5: length 22.9
  Bottom Layer w0.254: HDR2.10 37.15,70.28 37.15,63.81 38.23,62.73 U6.30
PA12: length 11.9
  Bottom Layer w0.254: U6.9 43.31,65.27 44.13,66.1 44.13,71.56 43.31,72.38 43.31,75.3 HDR1.9
PB0: length 22.9
  Bottom Layer w0.254: HDR2.13 44.77,70.28 44.77,63.81 45.85,62.73 U6.33
PB1: length 22.9
  Bottom Layer w0.254: U6.34 48.39,62.73 47.31,63.81 47.31,70.28 HDR2.14
PB4: length 11.9
  Bottom Layer w0.254: HDR1.12 35.69,75.3 35.69,72.38 36.51,71.56 36.51,66.1 35.69,65.27 U6.12
PB5: length 11.9
  Bottom Layer w0.254: U6.13 33.15,65.27 33.97,66.1 33.97,71.56 33.15,72.38 33.15,75.3 HDR1.13
PC13: length 22.9
  Bottom Layer w0.254: U6.22 17.91,62.73 16.83,63.81 16.83,70.28 HDR2.2
PC14: length 23.5
  Bottom Layer w0.254: U6.23 20.45,62.73 19.18,64 19.18,70.86 19.43,71.11 20.19,71.11
PC15: length 22.9
  Bottom Layer w0.254: HDR2.4 21.91,70.28 21.91,63.81 22.99,62.73 U6.24
PWMCH1: length 63.9
  Top Layer w0.254: A4950Left.5 59.82,47.11 59.82,65.39 59.56,65.65 58.17,65.65 57.09,64.57 57.09,63.81 56.45,63.17 55.56,63.17 54.48,64.25 U6.5
  Bottom Layer w0.254: U6.5 53.47,65.27 54.29,66.1 54.29,71.56 53.47,72.38 53.47,75.3 HDR1.5
PWMCH4: length 70.9
  Top Layer w0.254: A4950Right.3 68.45,40.76 68.45,64.89 65.02,68.32 49.91,68.32 U6.8
  Bottom Layer w0.254: HDR1.8 45.85,75.3 45.85,72.38 46.67,71.56 46.67,66.1 45.85,65.27 U6.8
RESET: length 22.9
  Bottom Layer w0.254: HDR2.17 54.93,70.28 54.93,63.81 56.01,62.73 U6.37
STM32-5V: length 12
  Bottom Layer w0.5: U6.18 20.45,69.66 21.4,70.61 21.4,71.61 20.45,72.56 20.45,75.3 HDR1.18
TIM2ENCODER1: length 122.9
  Top Layer w0.254: RightMotor.4 77.6,41.63 77.6,69.84 69.34,78.09 23.11,78.09 21.46,76.44 21.46,74.92 HDR2.5
  Bottom Layer w0.254: HDR2.5 24.45,70.28 24.45,63.81 25.53,62.73 U6.25
TIM2ENCODER2: length 135.2
  Top Layer w0.254: HDR2.6 26.8,71.11 25.72,70.03 24.83,70.03 24.19,70.66 24.19,71.55 22.99,72.76 21.34,72.76 19.18,74.92 19.18,76.06 21.72,78.6 69.98,78.6 78.1,70.47 78.1,39.63 RightMotor.3
  Bottom Layer w0.254: HDR2.6 26.99,70.28 26.99,63.81 28.07,62.73 U6.26
TIM3ENCODER1: length 84.4
  Top Layer w0.254: LeftMotor.4 8.6,35.7 18.27,26.03 30.73,26.03 35.18,30.47 35.18,35.93 44.39,45.13 44.39,49.46 43.75,50.09 42.86,50.09 41.78,49.01 U6.31
  Bottom Layer w0.254: HDR2.11 39.69,70.28 39.69,63.81 40.77,62.73 U6.31
TIM3ENCODER2: length 79.2
  Top Layer w0.254: U6.32 43.31,44.82 34.54,36.06 34.54,30.98 30.1,26.53 18.54,26.53 6.88,38.2 LeftMotor.3
  Bottom Layer w0.254: HDR2.12 42.23,70.28 42.23,63.81 43.31,62.73 U6.32
USART1RX: length 51.3
  Top Layer w0.254: U6.7 47.31,63.17 45.4,63.17 44.77,63.81 44.77,64.95 48.64,68.82 65.53,68.82 72.26,62.09 USART1.3
  Bottom Layer w0.254: U6.7 48.39,65.27 49.21,66.1 49.21,71.56 48.39,72.38 48.39,75.3 HDR1.7
USART1TX: length 68.4
  Top Layer w0.254: U6.6 48.51,61.84 43.31,61.84 42.16,62.98 42.16,67.17 44.45,69.46 65.79,69.46 69.34,65.9 74.62,65.9 75.42,65.1 75.42,61.63 74.29,60.5 USART1.2
  Bottom Layer w0.254: U6.6 50.93,65.27 51.75,66.1 51.75,71.56 50.93,72.38 50.93,75.3 HDR1.6
USART2RX: length 34
  Top Layer w0.254: U6.28 33.15,43.3 USART2.2
  Bottom Layer w0.254: HDR2.8 32.07,70.28 32.07,63.81 33.15,62.73 U6.28
USART2TX: length 34
  Top Layer w0.254: USART2.1 30.61,43.3 U6.27
  Bottom Layer w0.254: U6.27 30.61,62.73 29.53,63.81 29.53,70.28 HDR2.7
Y8SCL: length 40.1
  Top Layer w0.254: Y8.3 10.14,73.78 19.43,73.78 21.46,71.75 21.46,70.85 22.96,69.36 25.5,69.36 U6.14
  Bottom Layer w0.254: HDR1.14 30.61,75.3 30.61,72.38 31.43,71.56 31.43,66.1 30.61,65.27 U6.14
Y8SDA: length 39.9
  Top Layer w0.254: Y8.2 6.47,76.06 9.12,73.42 17.5,73.42 19.11,71.81 19.11,70.28 22.99,66.41 25.91,66.41 U6.15
  Bottom Layer w0.254: U6.15 28.07,65.27 28.89,66.1 28.89,71.56 28.07,72.38 28.07,75.3 HDR1.15
$1N30053: length 4.3
  Top Layer w0.5: 18.54,38.6 18.8,38.86 R1.1

## Copper pours and planes (outline as drawn; the poured copper is in the pictures)
GND on Bottom Layer: 0.64,78.98 79.12,78.98 79.12,1.39 0.64,1.39

## Text on the board
Top Silkscreen Layer: MOTORRIGHT- | GND | SIG | 5V | TX | RX | SDA | SCL | 3V3
